# Altium schematic sheet 008_ConsumptionBoard.SchDoc
size A4; Organization: OLTEST; Revision: 01; SheetNumber: 8; SheetTotal: 12; Название листа: Название листа; Разработчик: Бондарчук С.; Прибор: R100; АМАК.000000.000 Э3: R100.220.040.000 Э3; Дата: 14.01.2018; Формат: A4
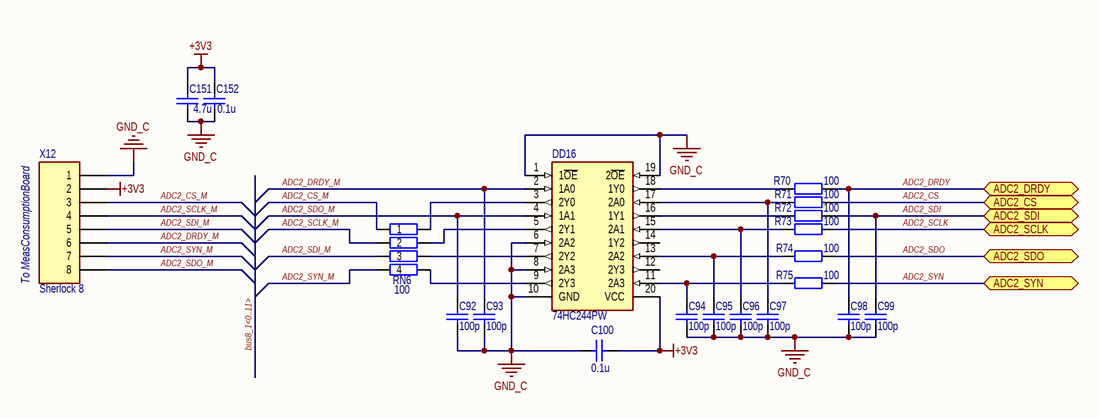
[diagram p0: 008_ConsumptionBoard.SchDoc]

## Parts
C92  100p  [SMD_C_0603]
C93  100p  [SMD_C_0603]
C94  100p  [SMD_C_0603]
C95  100p  [SMD_C_0603]
C96  100p  [SMD_C_0603]
C97  100p  [SMD_C_0603]
C98  100p  [SMD_C_0603]
C99  100p  [SMD_C_0603]
C100  0.1u  [SMD_C_0603]
C151  4.7u  [SMD_C_0805]
C152  0.1u  [SMD_C_0603]
DD16  74HC244PW  [TSSOP20]
R70  100  [SMD_R_0603]
R71  100  [SMD_R_0603]
R72  100  [SMD_R_0603]
R73  100  [SMD_R_0603]
R74  100  [SMD_R_0603]
R75  100  [SMD_R_0603]
RN6  100  [CRA06S]
X12  Sherlock 8  [35362-0850]

## Ports
ADC2_CS, ADC2_DRDY, ADC2_SCLK, ADC2_SDI, ADC2_SDO, ADC2_SYN

## Nets
+3V3: C100.2 C151.2 C152.2 DD16.20(VCC) X12.2
GND_C: C92.2 C93.2 C94.2 C95.2 C96.2 C97.2 C98.2 C99.2 C100.1 C151.1 C152.1 DD16.1(1~{OE}) DD16.6(2A2) DD16.8(2A3) DD16.10(GND) DD16.19(2~{OE}) X12.1
ADC2_CS: R71.2 ; port ADC2_CS
ADC2_CS_M: RN6.1 X12.3
ADC2_DRDY: C98.1 R70.2 ; port ADC2_DRDY
ADC2_DRDY_M: C93.1 DD16.2(1A0) X12.6
ADC2_SCLK: R73.2 ; port ADC2_SCLK
ADC2_SCLK_M: RN6.2 X12.4
ADC2_SDI: C99.1 R72.2 ; port ADC2_SDI
ADC2_SDI_M: RN6.3 X12.5
ADC2_SDO: R74.2 ; port ADC2_SDO
ADC2_SDO_M: C92.1 DD16.4(1A1) X12.8
ADC2_SYN: R75.2 ; port ADC2_SYN
ADC2_SYN_M: RN6.4 X12.7
NetC94_1: C94.1 DD16.11(2A3) R75.1
NetC95_1: C95.1 DD16.13(2A2) R74.1
NetC96_1: C96.1 DD16.15(2A1) R73.1
NetC97_1: C97.1 DD16.17(2A0) R71.1
NetDD16_3: DD16.3(2Y0) RN6.8
NetDD16_5: DD16.5(2Y1) RN6.7
NetDD16_7: DD16.7(2Y2) RN6.6
NetDD16_9: DD16.9(2Y3) RN6.5
NetDD16_16: DD16.16(1Y1) R72.1
NetDD16_18: DD16.18(1Y0) R70.1

Not connected (* = marked no-connect by the designer): DD16 12(2Y3) 14(1Y2)

## Buses and harness runs
bus bus8_1<0..11>

## Notes on the sheet
- (near X12) To MeasConsumptionBoard
- Разработчик:
- Формат:
- Rev.:
- Лист
- Дата:
- Листов
- WorkSpace:
- Дата изм.:

## Library data of the parts
C92-C99 = C0603 100p 100V 5%: SMD C 0603 MURATA 100V 5% NP0; PartNumber: GRM1885C2A101JA01; Manufacturer: MURATA; Value: 100p
C100 C152 = C0603 0.1u 50V 10%: SMD C 0603 MURATA 50V 10% X7R; PartNumber: GRM188R71H104K; Manufacturer: MURATA; Value: 0.1u
C151 = C0805 4.7u 25V 20%  X5R: SMD C 0805 MURATA 50V 5% NP0; PartNumber: GRM21BR61E475M; Manufacturer: MURATA; Value: 4.7u
DD16 = 74HC244PW: Octal Buffer/Line Driver with 3-State Outputs, PW0020A; Manufacturer: NXP; PartNumber: 74HC244PW
R70-R75 = R0603 100 1%: SMD R 0603 VISHAY 0.1W 75V 1% 100ppm; PartNumber: CRCW0603100RFK; Manufacturer: VISHAY; Value: 100
RN6 = CRA06S 4x100 1%: SMD RESISTOR ARRAY VISHAY 0.063W 50V 1% 100ppm; PartNumber: CRA06S083100RF; Manufacturer: VISHAY; Value: 100
X12 = 35362-0850: Sherlock 8 Side, 2A 125V 2mm; Manufacturer: MOLEX; PartNumber: 35362-0850